# Altium schematic sheet [03] SCH-03.SchDoc
size B; DocumentNumber: 3; SheetNumber: 3; SheetTotal: 8
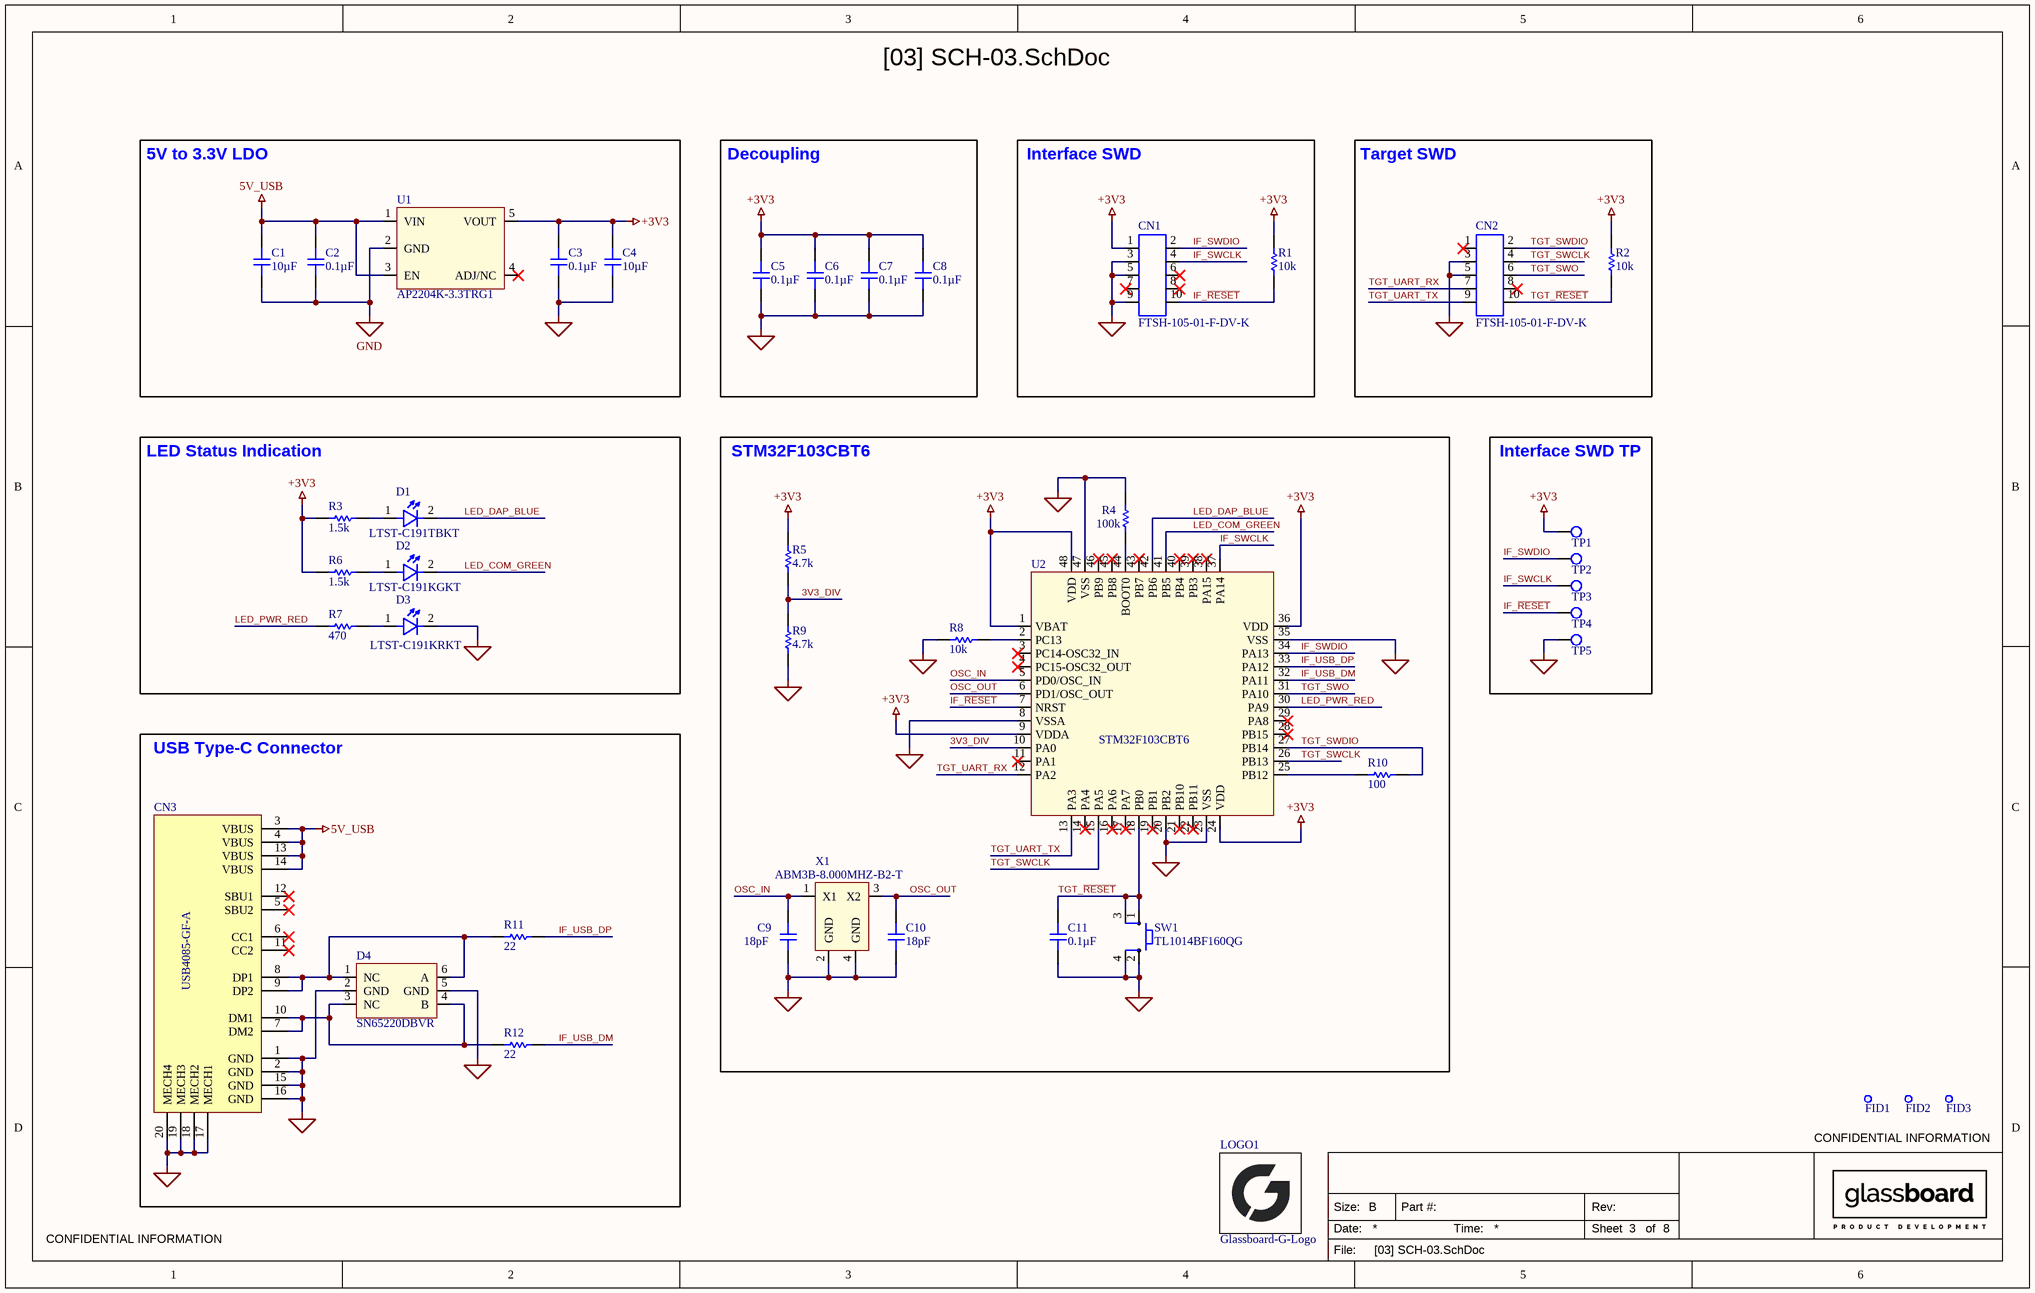
[diagram p0: [03] SCH-03.SchDoc]

## Parts
C1  10µF  [CAPC0402(1005)70_L]
C2  0.1µF  [CAPC0402(1005)70_L]
C3  0.1µF  [CAPC0402(1005)70_L]
C4  10µF  [CAPC0402(1005)70_L]
C5  0.1µF  [CAPC0402(1005)70_L]
C6  0.1µF  [CAPC0402(1005)70_L]
C7  0.1µF  [CAPC0402(1005)70_L]
C8  0.1µF  [CAPC0402(1005)70_L]
C9  18pF  [CAPC0402(1005)70_L]
C10  18pF  [CAPC0402(1005)70_L]
C11  0.1µF  [CAPC0402(1005)70_L]
CN1  FTSH-105-01-F-DV-K  [FTSH-105-01-F-DV-K]
CN2  FTSH-105-01-F-DV-K  [FTSH-105-01-F-DV-K]
CN3  USB4085-GF-A  [USB4085-GF-A]
D1  LTST-C191TBKT  [LTST-C191KGKT]
D2  LTST-C191KGKT  [LTST-C191KGKT]
D3  LTST-C191KRKT  [LTST-C191KGKT]
D4  SN65220DBVR  [SN65220DBVR-L]
FID1  FID  [fid_30mil]  (value not drawn)  (no BOM)
FID2  FID  [fid_30mil]  (value not drawn)  (no BOM)
FID3  FID  [fid_30mil]  (value not drawn)  (no BOM)
LOGO1  Glassboard-G-Logo
R1  10k  [RESC0402(1005)_L]
R2  10k  [RESC0402(1005)_L]
R3  1.5k  [RESC0402(1005)_L]
R4  100k  [RESC0402(1005)_L]
R5  4.7k  [RESC0402(1005)_L]
R6  1.5k  [RESC0402(1005)_L]
R7  470  [RESC0402(1005)_L]
R8  10k  [RESC0402(1005)_L]
R9  4.7k  [RESC0402(1005)_L]
R10  100  [RESC0402(1005)_L]
R11  22  [RESC0402(1005)_L]
R12  22  [RESC0402(1005)_L]
SW1  TL1014BF160QG  [TL1014BF160QG]
TP1  TESTFIXTURE_16MM  [TESTFIXTURE_16MM]  (value not drawn)
TP2  TESTFIXTURE_16MM  [TESTFIXTURE_16MM]  (value not drawn)
TP3  TESTFIXTURE_16MM  [TESTFIXTURE_16MM]  (value not drawn)
TP4  TESTFIXTURE_16MM  [TESTFIXTURE_16MM]  (value not drawn)
TP5  TESTFIXTURE_16MM  [TESTFIXTURE_16MM]  (value not drawn)
U1  AP2204K-3.3TRG1  [AP2204K-3.3TRG1_L]
U2  STM32F103CBT6  [STM32F103CBT6]
X1  ABM3B-8.000MHZ-B2-T  [ABM3B-8.000MHZ-B2-T]

## Blocks framed on the sheet
5V to 3.3V LDO: C1-C4 U1
Decoupling: C5-C8
Interface SWD: CN1 R1
Target SWD: CN2 R2
LED Status Indication: D1-D3 R3 R6 R7
STM32F103CBT6: C9-C11 R4 R5 R8-R10 SW1 U2 X1
Interface SWD TP: TP1-TP5
USB Type-C Connector: CN3 D4 R11 R12

## Nets
5V_USB: C1.2 C2.2 CN3.3(VBUS) CN3.4(VBUS) CN3.13(VBUS) CN3.14(VBUS) U1.1(VIN) U1.3(EN)
+3V3: C3.2 C4.2 C5.2 C6.2 C7.2 C8.2 CN1.1 R1.2 R2.2 R3.1 R5.2 R6.1 TP1.1 U1.5(VOUT) U2.1(VBAT) U2.9(VDDA) U2.24(VDD) U2.36(VDD) U2.48(VDD)
GND: C1.1 C2.1 C3.1 C4.1 C5.1 C6.1 C7.1 C8.1 C9.1 C10.1 C11.1 CN1.3 CN1.5 CN1.9 CN2.3 CN2.5 CN3.1(GND) CN3.2(GND) CN3.15(GND) CN3.16(GND) CN3.17(MECH1) CN3.18(MECH2) CN3.19(MECH3) CN3.20(MECH4) D3.2 D4.2(GND) D4.5(GND) R4.2 R8.1 R9.1 SW1.2 SW1.4 TP5.1 U1.2(GND) U2.8(VSSA) U2.20(PB2) U2.23(VSS) U2.35(VSS) U2.47(VSS) X1.2(GND) X1.4(GND)
3V3_DIV: R5.1 R9.2 U2.10(PA0)
IF_~{RESET}: CN1.10 R1.1 TP4.1 U2.7(NRST)
IF_SWCLK: CN1.4 TP3.1 U2.37(PA14)
IF_SWDIO: CN1.2 TP2.1 U2.34(PA13)
IF_USB_DM: R12.2 U2.32(PA11)
IF_USB_DP: R11.2 U2.33(PA12)
LED_COM_GREEN: D2.2 U2.41(PB5)
LED_DAP_BLUE: D1.2 U2.42(PB6)
LED_PWR_RED: R7.1 U2.30(PA9)
OSC_IN: C9.2 U2.5(PD0/OSC_IN) X1.1(X1)
OSC_OUT: C10.2 U2.6(PD1/OSC_OUT) X1.3(X2)
TGT_~{RESET}: C11.2 CN2.10 R2.1 SW1.1 SW1.3 U2.18(PB0)
TGT_SWCLK: CN2.4 U2.15(PA5) U2.26(PB13)
TGT_SWDIO: CN2.2 R10.2 U2.27(PB14)
TGT_SWO: CN2.6 U2.31(PA10)
TGT_UART_RX: CN2.7 U2.12(PA2)
TGT_UART_TX: CN2.9 U2.13(PA3)
NetCN3_7: CN3.7(DM2) CN3.10(DM1) D4.3(NC) D4.4(B) R12.1
NetCN3_8: CN3.8(DP1) CN3.9(DP2) D4.1(NC) D4.6(A) R11.1
NetD1_1: D1.1 R3.2
NetD2_1: D2.1 R6.2
NetD3_1: D3.1 R7.2
NetR4_1: R4.1 U2.44(BOOT0)
NetR8_2: R8.2 U2.2(PC13)
NetR10_1: R10.1 U2.25(PB12)

Not connected (* = marked no-connect by the designer): CN1 6* 7* 8*; CN2 1* 8*; CN3 5(SBU2)* 6(CC1)* 11(CC2)* 12(SBU1)*; FID1 0; FID2 0; FID3 0; U1 4(ADJ/NC)*; U2 3(PC14-OSC32_IN)* 4(PC15-OSC32_OUT)* 11(PA1)* 14(PA4)* 16(PA6)* 17(PA7)* 19(PB1)* 21(PB10)* 22(PB11)* 28(PB15)* 29(PA8)* 38(PA15)* 39(PB3)* 40(PB4)* 43(PB7)* 45(PB8)* 46(PB9)*

## Notes on the sheet
- CONFIDENTIAL INFORMATION
- Size:
- Date:
- B
- Part #:
- Time:
- Rev:
- Sheet
- of
- File:

## Library data of the parts
C1 C4 = CC0402MRX5R5BB106: CAP CER 10UF 6.3V X5R 0402; Manufacturer: Yageo; Tolerance: 0.2; ESD: NO; Part Number: CC0402MRX5R5BB106; Status: Active; Component Type: CAP - CHIP; Value: 10µF; Wattage: N/A; Voltage: 6.3V; Package Type: SMD; Package: CAP0402; Manufacturer Part Number: CC0402MRX5R5BB106; Distributor 1: Digi-Key; Distributor 1 Part Number: 311-1729-1-ND; DNP: *; Moisture Sensitivity: NO; Pin Count: 2; Published: 9/8/2017; Publisher: Randy Parmerlee
C2 C3 C5-C8 C11 = CGA2B2X5R1A104M050BA: CAP CER 0.1UF 10V X5R 0402; Manufacturer: TDK Corporation; Tolerance: 0.2; ESD: NO; Part Number: CGA2B2X5R1A104M050BA; Status: Active; Component Type: CAP - CHIP; Value: 0.1µF; Wattage: N/A; Voltage: 10V; Package Type: SMD; Package: CAP0402; Manufacturer Part Number: CGA2B2X5R1A104M050BA; Distributor 1: Digi-Key; Distributor 1 Part Number: 445-12157-1-ND; DNP: *; Moisture Sensitivity: NO; Pin Count: 2; Published: 12/9/2015; Publisher: Drew Westrick
C9 C10 = CC0402JRNPO9BN180: CAP CER 18PF 50V C0G/NPO 0402; Manufacturer: Yageo; Tolerance: 0.05; ESD: NO; Part Number: CC0402JRNPO9BN180; Status: Active; Component Type: CAP - CHIP; Value: 18pF; Wattage: N/A; Voltage: 50V; Package Type: SMD; Package: CAP0402; Manufacturer Part Number: CC0402JRNPO9BN180; Distributor 1: Digi-Key; Distributor 1 Part Number: 311-1415-1-ND; DNP: *; Moisture Sensitivity: NO; Pin Count: 2; Published: 9/8/2017; Publisher: Randy Parmerlee
CN1 CN2 = FTSH-105-01-F-DV-K: CONN HEADER 10POS DUAL .05" SMD; Manufacturer: Samtec Inc; ESD: NO; Part Number: FTSH-105-01-F-DV-K; Status: Active; Component Type: CONN - SMD; Value: FTSH-105-01-F-DV-K; Voltage: N/A; Current: N/A; Package Type: SMD; Manufacturer Part Number: FTSH-105-01-F-DV-K; Distributor 1: Digi-Key; Distributor 1 Part Number: SAM8796-ND; DNP: *; Moisture Sensitivity: NO; Pin Count: 10; Published: 10/4/2016; Publisher: Drew Westrick
CN3 = USB4085-GF-A: CONN RCPT USB2.0 TYPEC 16POS; Manufacturer: GCT; ESD: NO; Part Number: USB4085-GF-A; Status: Active; Component Type: CONN - PTH; Value: USB4085-GF-A; Voltage: N/A; Current: N/A; Package Type: PTH; Manufacturer Part Number: USB4085-GF-A; Distributor 1: Digi-Key; Distributor 1 Part Number: 2073-USB4085-GF-ACT-ND; DNP: *; Moisture Sensitivity: NO; Pin Count: 20; Published: 12/8/2020; Publisher: Stephen Murphy
D1 = LTST-C191TBKT: LED BLUE CLEAR 0603 SMD; Manufacturer: Lite-On Inc; ESD: YES; Part Number: LTST-C191TBKT; Status: Active; Component Type: LED - SMD; Value: LTST-C191TBKT; Tolerance: N/A; Wattage: N/A; Voltage: N/A; Package Type: SMD; Package: LED0603; Manufacturer Part Number: LTST-C191TBKT; Distributor 1: Digi-Key; Distributor 1 Part Number: 160-1647-1-ND; DNP: *; Moisture Sensitivity: YES; Pin Count: 2; Published: 6/8/2016; Publisher: Randy Parmerlee
D2 = LTST-C191KGKT: LED GREEN CLEAR THIN 0603 SMD; Manufacturer: Lite-On Inc; ESD: YES; Part Number: LTST-C191KGKT; Status: Active; Component Type: LED - SMD; Value: LTST-C191KGKT; Tolerance: N/A; Wattage: N/A; Voltage: N/A; Package Type: SMD; Package: LED0603; Manufacturer Part Number: LTST-C191KGKT; Distributor 1: Digi-Key; Distributor 1 Part Number: 160-1446-1-ND; DNP: *; Moisture Sensitivity: YES; Pin Count: 2; Published: 8/25/2015; Publisher: Randy Parmerlee
D3 = LTST-C191KRKT: LED RED CLEAR 0603 SMD; Manufacturer: Lite-On Inc; ESD: YES; Part Number: LTST-C191KRKT; Status: Active; Component Type: LED - SMD; Value: LTST-C191KRKT; Tolerance: N/A; Wattage: N/A; Voltage: N/A; Package Type: SMD; Package: LED0603; Manufacturer Part Number: LTST-C191KRKT; Distributor 1: Digi-Key; Distributor 1 Part Number: 160-1447-1-ND; DNP: *; Moisture Sensitivity: YES; Pin Count: 2; Published: 6/8/2016; Publisher: Randy Parmerlee
D4 = SN65220DBVR: IC SINGLE USB PORT TVS SOT-23-6; Manufacturer: Texas Instruments; Voltage: 5V; ESD: YES; Part Number: SN65220DBVR; Status: Active; Component Type: DIO - SMD; Value: SN65220DBVR; Tolerance: N/A; Current: N/A; Package Type: SMD; Package: SOT-23-6; Manufacturer Part Number: SN65220DBVR; Distributor 1: Digi-Key; Distributor 1 Part Number: 296-9694-1-ND; DNP: *; Moisture Sensitivity: YES; Pin Count: 6; Published: 5/9/2016; Publisher: Randy Parmerlee
FID1-FID3 = Fiducial: Surface Mount Fiducials; ESD: NO; Part Number: Fiducial; Status: Active; Component Type: FID - SMD; Value: FID; Voltage: N/A; Current: N/A; Package Type: N/A; Manufacturer: N/A; Manufacturer Part Number: N/A; Distributor 1: N/A; Distributor 1 Part Number: N/A; DNP: *; Moisture Sensitivity: NO; Pin Count: 1; Published: 11/19/2015; Publisher: Randy Parmerlee
R1 R2 R8 = RC0402FR-0710KL: RES SMD 10K OHM 1% 1/16W 0402; Manufacturer: Yageo; Tolerance: 0.01; Wattage: 0.063W; ESD: NO; Part Number: RC0402FR-0710KL; Status: Active; Component Type: RES - CHIP; Value: 10k; Voltage: N/A; Package Type: SMD; Package: RES0402; Manufacturer Part Number: RC0402FR-0710KL; Distributor 1: Digi-Key; Distributor 1 Part Number: 311-10.0KLRCT-ND; DNP: *; Moisture Sensitivity: NO; Pin Count: 2; Published: 9/6/2017; Publisher: Randy Parmerlee
R3 R6 = ERJ-2RKF1501X: RES SMD 1.5K OHM 1% 1/10W 0402; Manufacturer: Panasonic Electronic Components; Tolerance: 0.01; Wattage: 0.1W; ESD: NO; Part Number: ERJ-2RKF1501X; Status: Not For Use; Component Type: RES - CHIP; Value: 1.5k; Voltage: N/A; Package Type: SMD; Package: RES0402; Manufacturer Part Number: ERJ-2RKF1501X; Distributor 1: Digi-Key; Distributor 1 Part Number: P1.50KLCT-ND; DNP: *; Moisture Sensitivity: NO; Pin Count: 2; Published: 12/9/2015; Publisher: Drew Westrick
R4 = RC0402FR-07100KL: RES SMD 100K OHM 1% 1/16W 0402; Manufacturer: Yageo; Tolerance: 0.01; Wattage: 0.063W; ESD: NO; Part Number: RC0402FR-07100KL; Status: Active; Component Type: RES - CHIP; Value: 100k; Voltage: N/A; Package Type: SMD; Package: RES0402; Manufacturer Part Number: RC0402FR-07100KL; Distributor 1: Digi-Key; Distributor 1 Part Number: 311-100KLRCT-ND; DNP: *; Moisture Sensitivity: NO; Pin Count: 2; Published: 9/6/2017; Publisher: Randy Parmerlee
R5 R9 = ERJ-2RKF4701X: RES SMD 4.7K OHM 1% 1/10W 0402; Manufacturer: Panasonic Electronic Components; Tolerance: 0.01; Wattage: 0.1W; ESD: NO; Part Number: ERJ-2RKF4701X; Status: Not For Use; Component Type: RES - CHIP; Value: 4.7k; Voltage: N/A; Package Type: SMD; Package: RES0402; Manufacturer Part Number: ERJ-2RKF4701X; Distributor 1: Digi-Key; Distributor 1 Part Number: P4.70KLCT-ND; DNP: *; Moisture Sensitivity: NO; Pin Count: 2; Published: 12/9/2015; Publisher: Drew Westrick
R7 = ERJ-2RKF4700X: RES SMD 470 OHM 1% 1/10W 0402; Manufacturer: Panasonic Electronic Components; Tolerance: 0.01; Wattage: 0.1W; ESD: NO; Part Number: ERJ-2RKF4700X; Status: Not For Use; Component Type: RES - CHIP; Value: 470; Voltage: N/A; Package Type: SMD; Package: RES0402; Manufacturer Part Number: ERJ-2RKF4700X; Distributor 1: Digi-Key; Distributor 1 Part Number: P470LCT-ND; DNP: *; Moisture Sensitivity: NO; Pin Count: 2; Published: 12/9/2015; Publisher: Drew Westrick
R10 = RC0402FR-07100RL: RES SMD 100 OHM 1% 1/16W 0402; Manufacturer: Yageo; Tolerance: 0.01; Wattage: 0.063W; ESD: NO; Part Number: RC0402FR-07100RL; Status: Active; Component Type: RES - CHIP; Value: 100; Voltage: N/A; Package Type: SMD; Package: RES0402; Manufacturer Part Number: RC0402FR-07100RL; Distributor 1: Digi-Key; Distributor 1 Part Number: 311-100LRCT-ND; DNP: *; Moisture Sensitivity: NO; Pin Count: 2; Published: 9/6/2017; Publisher: Randy Parmerlee
R11 R12 = RC0402FR-0722RL: RES SMD 22 OHM 1% 1/16W 0402; Manufacturer: Yageo; Tolerance: 0.01; Wattage: 0.063W; ESD: NO; Part Number: RC0402FR-0722RL; Status: Active; Component Type: RES - CHIP; Value: 22; Voltage: N/A; Package Type: SMD; Package: RES0402; Manufacturer Part Number: RC0402FR-0722RL; Distributor 1: Digi-Key; Distributor 1 Part Number: 311-22.0LRCT-ND; DNP: *; Moisture Sensitivity: NO; Pin Count: 2; Published: 9/6/2017; Publisher: Randy Parmerlee
SW1 = TL1014BF160QG: SWITCH TACTILE SPST-NO 0.05A 12V; Manufacturer: E-Switch; ESD: NO; Part Number: TL1014BF160QG; Status: Active; Component Type: SWITCH - SMD; Value: TL1014BF160QG; Voltage: N/A; Current: 0.05A; Package Type: SMD; Package: Gull Wing; Manufacturer Part Number: TL1014BF160QG; Distributor 1: Digi-Key; Distributor 1 Part Number: EG5042CT-ND; DNP: *; Moisture Sensitivity: NO; Pin Count: 4; Published: 10/8/2018; Publisher: Randy Parmerlee
TP1-TP5 = TESTFIXTURE_16MM: TEST POINT ROUND 1.6mm; Manufacturer: GlassBoard; Part Number: TESTFIXTURE_16MM; Status: Actiive; Component Type: TP - SMD; Value: TESTFIXTURE_16MM; Current: N/A; Voltage: N/A; Package Type: SMD; Package: TP16MMSMD; Manufacturer Part Number: TESTFIXTURE_16MM; Distributor 1: GlassBoard; Distributor 1 Part Number: N/A; DNP: *; Pin Count: 1; Published: 12/8/2020; Publisher: Ethan Harmon
U1 = AP2204K-3.3TRG1: IC REG LDO 3.3V 0.15A SOT25; Manufacturer: Diodes Incorporated; Voltage: 24V; ESD: YES; Part Number: AP2204K-3.3TRG1; Status: Active; Component Type: IC - LDO; Value: AP2204K-3.3TRG1; Package Type: SMD; Package: SOT-23-5; Manufacturer Part Number: AP2204K-3.3TRG1; Distributor 1: Digi-Key; Distributor 1 Part Number: AP2204K-3.3TRG1DITR-ND; DNP: *; Moisture Sensitivity: YES; Pin Count: 5; Published: 6/14/2017; Publisher: Randy Parmerlee
U2 = STM32F103CBT6: IC MCU 32BIT 128KB FLASH 48LQFP; Manufacturer: STMicroelectronics; Voltage: 2V ~ 3.6V; ESD: YES; Part Number: STM32F103CBT6; Status: Active; Component Type: IC - MICRO; Value: STM32F103CBT6; Package Type: SMD; Package: LQFP-48; Manufacturer Part Number: STM32F103CBT6; Distributor 1: Digi-Key; Distributor 1 Part Number: 497-6288-ND; DNP: *; Moisture Sensitivity: YES; Pin Count: 48; Published: 12/7/2020; Publisher: Stephen Murphy
X1 = ABM3B-8.000MHZ-B2-T: CRYSTAL 8.0000MHZ 18PF SMD; Manufacturer: Abracon LLC; ESD: YES; Part Number: ABM3B-8.000MHZ-B2-T; Status: Active; Component Type: OSC - SMD; Value: ABM3B-8.000MHZ-B2-T; Voltage: N/A; Package Type: SMD; Package: SDM-4; Manufacturer Part Number: ABM3B-8.000MHZ-B2-T; Distributor 1: Digi-Key; Distributor 1 Part Number: 535-9720-1-ND; DNP: *; Moisture Sensitivity: YES; Pin Count: 4; Published: 9/18/2018; Publisher: Randy Parmerlee